# Altium project tcc_semsf_com.PrjPcb
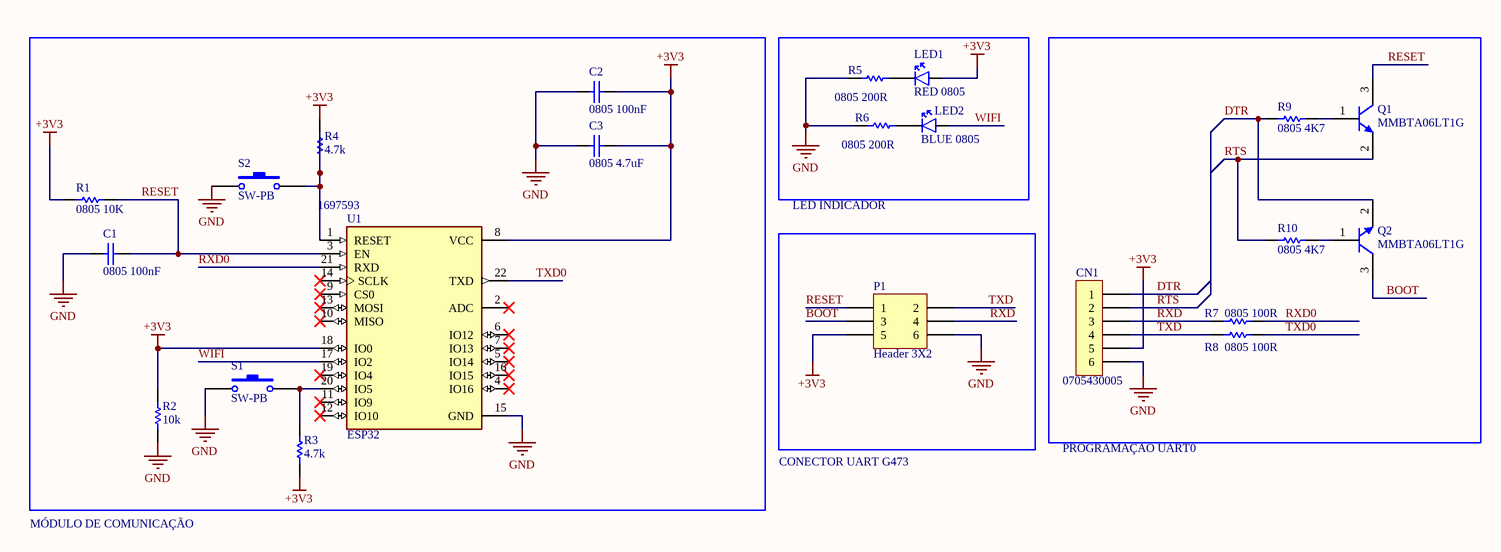
[diagram p0: Main.SchDoc]
1 sheet, 22 parts. Net scope: global (net labels, ports and power ports of the same name join across sheets).
Board file: Main.PcbDoc

## Sheet Main.SchDoc: Comunicação
size A4; Author: Matheus Gois Vieira; Address1: UnB; Address2: Faculdade do Gama

### Parts
C1  0805 100nF  [CAP0805]
C2  0805 100nF  [CAP0805]
C3  0805 4.7uF  [CAP0805]
CN1  0705430005  [FP-0705430005-MFG]
LED1  RED 0805  [LEDC2012X80N]
LED2  BLUE 0805  [LEDC2012X80N]
P1  Header 3X2  [HDR2X3M]
Q1  MMBTA06LT1G  [ONSC-SOT-23-3-318-08_V]
Q2  MMBTA06LT1G  [ONSC-SOT-23-3-318-08_V]
R1  0805 10K  [RES0805]
R2  10k  [R1608[0603]]
R3  4.7k  [R1005[0402]]
R4  4.7k  [R1005[0402]]
R5  0805 200R  [RES0805]
R6  0805 200R  [RES0805]
R7  0805 100R  [RES0805]
R8  0805 100R  [RES0805]
R9  0805 4K7  [RES0805]
R10  0805 4K7  [RES0805]
S1  SW-PB  [PB-SW]
S2  SW-PB  [PB-SW]
U1  ESP32  Supplier Part Number 1: 1697593  [XCVR_ESP8266-12E/ESP-12E]

### Nets
+3V3: C2.2 C3.2 CN1.5 LED1.2(A) P1.5 R1.1 R2.2 R3.2 R4.2 U1.8(VCC) U1.18(IO0)
GND: C1.1 C2.1 C3.1 CN1.6 P1.6 R2.1 R5.1 R6.1 S1.1 S2.1 U1.15(GND)
BOOT: P1.3 Q2.3(C)
DTR: CN1.1 Q2.2(E) R9.1
RESET: C1.2 P1.1 Q1.3(C) R1.2 U1.3(EN)
RTS: CN1.2 Q1.2(E) R10.1
RXD: CN1.3 P1.4 R7.1
RXD0: R7.2 U1.21(RXD)
TXD: CN1.4 P1.2 R8.1
TXD0: R8.2 U1.22(TXD)
WIFI: LED2.2(A) U1.17(IO2)
NetLED1_1: LED1.1(K) R5.2
NetLED2_1: LED2.1(K) R6.2
NetQ1_1: Q1.1(B) R9.2
NetQ2_1: Q2.1(B) R10.2
NetR3_1: R3.1 S1.2 U1.20(IO5)
NetR4_1: R4.1 S2.2 U1.1(RESET)

Not connected (* = marked no-connect by the designer): U1 2(ADC)* 4(IO16)* 5(IO14)* 6(IO12)* 7(IO13)* 9(CS0)* 10(MISO)* 11(IO9)* 12(IO10)* 13(MOSI)* 14(SCLK)* 16(IO15)* 19(IO4)*

### Notes on the sheet
- LED INDICADOR
- CONECTOR UART G473
- PROGRAMAÇÃO UART0
- MÓDULO DE COMUNICAÇÃO
- Title
- Size:
- Date:
- A4
- Author:
- Time:
- Sheet
- of
- File:

### Library data of the parts
C1 C2 = CC0805KRX7R9BB104: CC Series 0805 0.1 uF 50 V ±10 % Tolerance X7R SMT Multilayer Ceramic Capacitor; Manufacturer: Yageo; Tolerance: 10%; Voltage Rating: 50V; Insulation Resistance: 100GR; Supplier 1: Digi-Key; Manufacturer Part Number: CC0805KRX7R9BB104; RoHS: Yes; Category: Ceramic Capacitors; Stock 1: 7319595; Pricing 1: 4000=0,01864, 8000=0,01734 (USD); Mount: Surface Mount; Case/Package: 0805; Number of Pins: 2; Case Code (Metric): 2012; Case Code (Imperial): 0805; Material: Ceramic; Min Operating Temperature: -55°C; Max Operating Temperature: 125°C; Capacitance: 100nF; Dielectric: X7R; Packaging: Tape and Reel; Package Quantity: 1; Termination: SMD/SMT; Voltage: 50V; Series: CC; Length: 2mm; Width: 0.049inch; Height: 0.85mm; Depth: 1.25mm; Thickness: 0.033inch; Radiation Hardening: No; REACH SVHC: No SVHC; Lead Free: Lead Free; Halogen Free: Halogen Free; RoHS Compliant: Yes; ComponentLink1URL: https://datasheet.ciiva.com/11786/0900766b80d84f1d-11786009.pdf?src-supplier=RSComponents; ComponentLink1Description: https://datasheet.ciiva.com/11786/0900766b80d84f1d-11786009.pdf?src-supplier=RSComponents; ComponentLink2URL: https://datasheet.ciiva.com/155/mlccorderingcode-155929.pdf?src-supplier=Digi-Key; ComponentLink2Description: https://datasheet.ciiva.com/155/mlccorderingcode-155929.pdf?src-supplier=Digi-Key; ComponentLink3URL: https://datasheet.ciiva.com/155/mlccorderingcode-155930.pdf?src-supplier=Digi-Key; ComponentLink3Description: https://datasheet.ciiva.com/155/mlccorderingcode-155930.pdf?src-supplier=Digi-Key; ComponentLink4URL: https://datasheet.ciiva.com/155/mlccorderingcode-155931.pdf?src-supplier=Digi-Key; ComponentLink4Description: https://datasheet.ciiva.com/155/mlccorderingcode-155931.pdf?src-supplier=Digi-Key; ComponentLink5URL: https://datasheet.ciiva.com/11464/upy-gphc-x7r-6-3v-to-50v-8-11464757.pdf?src-supplier=Avnet; ComponentLink5Description: https://datasheet.ciiva.com/11464/upy-gphc-x7r-6-3v-to-50v-8-11464757.pdf?src-supplier=Avnet; ComponentLink6URL: https://datasheet.ciiva.com/16625/upy-gphc-x7r-6-3v-to-50v-8-16625549.pdf?src-supplier=Avnet+Europe; ComponentLink6Description: https://datasheet.ciiva.com/16625/upy-gphc-x7r-6-3v-to-50v-8-16625549.pdf?src-supplier=Avnet+Europe; ComponentLink7URL: https://datasheet.ciiva.com/28450/1489800-28450805.pdf?src-supplier=Element14; ComponentLink7Description: https://datasheet.ciiva.com/28450/1489800-28450805.pdf?src-supplier=Element14; ComponentLink8URL: https://datasheet.ciiva.com/46393/1734573-46393307.pdf?src-supplier=Element14; ComponentLink8Description: https://datasheet.ciiva.com/46393/1734573-46393307.pdf?src-supplier=Element14; ComponentLink9URL: https://datasheet.ciiva.com/29242/445210-da-01-en-kerko-chip-0805-x7r-0-1uf-10proz-50vg-29242074.pdf?src-supplier=Conrad; ComponentLink9Description: https://datasheet.ciiva.com/29242/445210-da-01-en-kerko-chip-0805-x7r-0-1uf-10proz-50vg-29242074.pdf?src-supplier=Conrad; Supplier Part Number 1: 311-1140-2-ND
C3 = C2012X5R1H475K125AB: 4.7uF ±10% 50V 0805; Manufacturer: TDK; Dielectric Material: Ceramic; Dielectric: X5R; Supplier 1: RSComponents; Manufacturer Part Number: C2012X5R1H475K125AB; RoHS: Yes; Category: Ceramic Capacitors; Stock 1: 610; Pricing 1: 10=0,38900, 100=0,36600, 250=0,34200, 500=0,32300, 1000=0,29200 (USD); Mount: Surface Mount; Case/Package: 0805; Case Code (Metric): 2012; Case Code (Imperial): 0805; Weight: 0.000194oz; Min Operating Temperature: -55°C; Max Operating Temperature: 85°C; Capacitance: 4.7uF; Tolerance: 10%; Packaging: Tape and Reel; Package Quantity: 1; Voltage Rating: 50V; Series: C; Voltage Rating (DC): 50V; Termination: SMD/SMT; Construction: Flat; Voltage: 50V; Resistor Type: Ceramic; Length: 2mm; Width: 0.049inch; Height: 1.25mm; Depth: 1.25mm; Thickness: 0.057inch; Radiation Hardening: No; RoHS Compliant: Yes; REACH SVHC: No SVHC; Lead Free: Lead Free; ComponentLink1URL: https://datasheet.ciiva.com/24216/c2012x5r1h475k125ab-265006-24216434.pdf?src-supplier=Mouser; ComponentLink1Description: https://datasheet.ciiva.com/24216/c2012x5r1h475k125ab-265006-24216434.pdf?src-supplier=Mouser; ComponentLink2URL: https://datasheet.ciiva.com/22725/1913358-22725564.pdf?src-supplier=Element14; ComponentLink2Description: https://datasheet.ciiva.com/22725/1913358-22725564.pdf?src-supplier=Element14; ComponentLink3URL: https://datasheet.ciiva.com/28673/mlcc-commercial-general-en-28673541.pdf?src-supplier=Element14; ComponentLink3Description: https://datasheet.ciiva.com/28673/mlcc-commercial-general-en-28673541.pdf?src-supplier=Element14; ComponentLink4URL: https://datasheet.ciiva.com/6276/tdkmlcccaprange-6276526.pdf?src-supplier=Digi-Key; ComponentLink4Description: https://datasheet.ciiva.com/6276/tdkmlcccaprange-6276526.pdf?src-supplier=Digi-Key; ComponentLink5URL: https://datasheet.ciiva.com/48671/e412-c-48671374.pdf?src-supplier=Avnet; ComponentLink5Description: https://datasheet.ciiva.com/48671/e412-c-48671374.pdf?src-supplier=Avnet; Supplier Part Number 1: 7883041
CN1 = 0705430005: Conn Shrouded Header (4 Sides) HDR 6 POS 2.54mm Solder ST Top Entry Thru-Hole SL™ Tube; Manufacturer: Molex; Contact Resistance: 30mR; Number of Positions: 6; Connector Type: Male Pin; Pitch: 0.1inch; Supplier 1: RSComponents; Manufacturer Part Number: 0705430005; RoHS: Yes; Category: Headers and Wire Housings; Stock 1: 440; Pricing 1: 10=1,32100, 200=1,15000, 750=0,92500, 3000=0,75400, 6000=0,73000 (USD); Mount: Through Hole; Contact Plating: Gold; Contact Material: Bronze; Color: Black; Housing Color: Black; Housing Material: Polyester; Min Operating Temperature: -40°C; Max Operating Temperature: 105°C; Packaging: Rail/Tube; Number of Rows: 1; Termination: Solder; Orientation: Straight; Series: C-Grid® SL™ 70543; Contact Type: Male Pin; Length: 17.79mm; Depth: 6.6mm; Contact Mating Length: 0.24inch; Radiation Hardening: No; RoHS Compliant: Yes; ComponentLink1URL: http://components.arrow.com/part/dataview/2934603S3153303N3303?src-supplier=Arrow+Electronics; ComponentLink1Description: http://components.arrow.com/part/dataview/2934603S3153303N3303?src-supplier=Arrow+Electronics; ComponentLink2URL: http://components.arrow.com/part/dataview/0323_00048382?src-supplier=Arrow+Europe; ComponentLink2Description: http://components.arrow.com/part/dataview/0323_00048382?src-supplier=Arrow+Europe; Supplier Part Number 1: 6792483
LED1 LED2 = 150080RS75000: Red SMD 625nm LED Indication - Discrete 2V 0805 (2012 Metric); Manufacturer_Name: Wurth Elektronik; Datasheet Link: https://componentsearchengine.com/Datasheets/2/150080RS75000.pdf; Height: 0.8mm; Manufacturer_Part_Number: 150080RS75000; Mouser Part Number: 710-150080RS75000; Mouser Price/Stock: https://www.mouser.co.uk/ProductDetail/Wurth-Elektronik/150080RS75000?qs=LlUlMxKIyB2jdCo7bnfgew%3D%3D
P1 = Header 3X2: Header, 3-Pin, Dual row; LatestRevisionDate: 17-Jul-2002; LatestRevisionNote: Re-released for DXP Platform.; Publisher: Altium Limited
Q1 Q2 = MMBTA06LT1G: Trans GP BJT NPN 80V 0.5A 3-Pin SOT-23 T/R; Manufacturer: ON Semiconductor; Max Power Dissipation: 225mW; Number of Elements: 1; Frequency: 100MHz; Emitter Base Voltage (VEBO): 4V; Collector Emitter Saturation Voltage: 250mV; Max Collector Current: 500mA; Power Dissipation: 300mW; Element Configuration: Single; hFE Min: 100; Supplier 1: Digi-Key; Manufacturer Part Number: MMBTA06LT1G; RoHS: Yes; Category: BJTs; Stock 1: 9300; Pricing 1: 1=0,17000, 10=0,12300, 25=0,11800, 100=0,06650, 500=0,05220, 1000=0,03625 (USD); Case/Package: SOT-23-3; Number of Pins: 3; Contact Plating: Tin,Matte; Min Operating Temperature: -55°C; Max Operating Temperature: 150°C; Package Quantity: 1; Collector Emitter Voltage (VCEO): 80V; Packaging: Tape and Reel; Polarity: NPN; Collector Base Voltage (VCBO): 80V; Collector Emitter Breakdown Voltage: 80V; Transition Frequency: 100MHz; Max Breakdown Voltage: 80V; Max Frequency: 100MHz; Gain Bandwidth Product: 100MHz; Collector-emitter Voltage-Max: 250mV; Series: -; Voltage Rating (DC): 80V; Current Rating: 500mA; Length: 0.119inch; Width: 0.055inch; Height: 0.04inch; Radiation Hardening: No; REACH SVHC: No SVHC; Lead Free: Lead Free; RoHS Compliant: Yes; ComponentLink1URL: https://datasheet.ciiva.com/4722/mmbta05lt1-d-101659-4722113.pdf?src-supplier=Mouser; ComponentLink1Description: https://datasheet.ciiva.com/4722/mmbta05lt1-d-101659-4722113.pdf?src-supplier=Mouser; ComponentLink2URL: https://datasheet.ciiva.com/15139/getdatasheetpartid-137838-15139444.pdf?src-supplier=Verical; ComponentLink2Description: https://datasheet.ciiva.com/15139/getdatasheetpartid-137838-15139444.pdf?src-supplier=Verical; ComponentLink3URL: https://datasheet.ciiva.com/976/mmbta05lt1-d-976473.pdf?src-supplier=Digi-Key; ComponentLink3Description: https://datasheet.ciiva.com/976/mmbta05lt1-d-976473.pdf?src-supplier=Digi-Key; ComponentLink4URL: https://datasheet.ciiva.com/976/mmbta05lt1-d-976474.pdf?src-supplier=Digi-Key; ComponentLink4Description: https://datasheet.ciiva.com/976/mmbta05lt1-d-976474.pdf?src-supplier=Digi-Key; ComponentLink5URL: https://datasheet.ciiva.com/976/mmbta05lt1-d-976475.pdf?src-supplier=Digi-Key; ComponentLink5Description: https://datasheet.ciiva.com/976/mmbta05lt1-d-976475.pdf?src-supplier=Digi-Key; ComponentLink6URL: https://datasheet.ciiva.com/11197/mmbta05lt1-d-11197414.pdf?src-supplier=Avnet; ComponentLink6Description: https://datasheet.ciiva.com/11197/mmbta05lt1-d-11197414.pdf?src-supplier=Avnet; ComponentLink7URL: https://datasheet.ciiva.com/11198/mmbta05lt1-d-11198678.pdf?src-supplier=Avnet; ComponentLink7Description: https://datasheet.ciiva.com/11198/mmbta05lt1-d-11198678.pdf?src-supplier=Avnet; ComponentLink8URL: https://datasheet.ciiva.com/25998/mmbta05lt1-d-25998830.pdf?src-supplier=Avnet+Europe; ComponentLink8Description: https://datasheet.ciiva.com/25998/mmbta05lt1-d-25998830.pdf?src-supplier=Avnet+Europe; ComponentLink9URL: https://datasheet.ciiva.com/16465/mmbta05lt1-d-16465685.pdf?src-supplier=Future+Electronics; ComponentLink9Description: https://datasheet.ciiva.com/16465/mmbta05lt1-d-16465685.pdf?src-supplier=Future+Electronics; ComponentLink10URL: https://datasheet.ciiva.com/7972/mmbta05lt1-d-7972078.pdf?src-supplier=Element14; ComponentLink10Description: https://datasheet.ciiva.com/7972/mmbta05lt1-d-7972078.pdf?src-supplier=Element14; ComponentLink11URL: https://datasheet.ciiva.com/16478/mmbta05lt1-d-16478574.pdf?src-supplier=Avnet+Asia; ComponentLink11Description: https://datasheet.ciiva.com/16478/mmbta05lt1-d-16478574.pdf?src-supplier=Avnet+Asia; Supplier Part Number 1: MMBTA06LT1GOSCT-ND; Supplier 2: Avnet; Supplier Part Number 2: MMBTA06LT1G
R1 = RC0805FR-0710KL: 10K Omhs 0805 ± 1.00% 0.125W ± 100ppm/℃; Manufacturer: Yageo; Manufacturer Part Number: RC0603FR-0710KL; Tolerance: 1%; Resistance: 10kR; Temperature Coefficient: 100ppm/°C; Voltage Rating: 75V; Voltage Rating (DC): 50V; Power Rating: 100mW; RoHS: Yes; Category: Chip SMD Resistors; Stock 1: 19091268; Pricing 1: 5000=0,00312 (USD); Case/Package: 0603; Number of Pins: 2; Case Code (Imperial): 0603; Case Code (Metric): 1608; Weight: 7.1E-05oz; Size Code: 0603; Min Operating Temperature: -55°C; Max Operating Temperature: 155°C; Resistor Type: Thick Film; Packaging: Tape and Reel; Termination: SMD/SMT; Features: Moisture Resistant; Series: RC; Max Power Dissipation: 100mW; Number of Terminations: 2; Resistance Tolerance: 1%; Construction: Rectangular; Length: 1.6mm; Width: 0.8mm; Height: 0.45mm; Depth: 0.8mm; Lead Pitch: 0.3mm; RoHS Compliant: Yes; REACH SVHC: Unknown; Military Standard: Not; Lead Free: Lead Free; ComponentLink1URL: https://datasheet.ciiva.com/7660/38590-7660789.pdf?src-supplier=Element14; ComponentLink1Description: https://datasheet.ciiva.com/7660/38590-7660789.pdf?src-supplier=Element14; ComponentLink2URL: https://datasheet.ciiva.com/7983/443971-7983596.pdf?src-supplier=Element14; ComponentLink2Description: https://datasheet.ciiva.com/7983/443971-7983596.pdf?src-supplier=Element14; ComponentLink3URL: https://datasheet.ciiva.com/22747/443971-22747519.pdf?src-supplier=Element14; ComponentLink3Description: https://datasheet.ciiva.com/22747/443971-22747519.pdf?src-supplier=Element14; ComponentLink4URL: https://datasheet.ciiva.com/46440/1868787-46440891.pdf?src-supplier=Element14; ComponentLink4Description: https://datasheet.ciiva.com/46440/1868787-46440891.pdf?src-supplier=Element14; ComponentLink5URL: https://datasheet.ciiva.com/7746/1738695-7746239.pdf?src-supplier=Element14; ComponentLink5Description: https://datasheet.ciiva.com/7746/1738695-7746239.pdf?src-supplier=Element14; ComponentLink6URL: https://datasheet.ciiva.com/15189/getdatasheetpartid-409289-15189591.pdf?src-supplier=Verical; ComponentLink6Description: https://datasheet.ciiva.com/15189/getdatasheetpartid-409289-15189591.pdf?src-supplier=Verical; Stock 2: 435000; Pricing 2: 5000=0,00700 (USD); Package Quantity: 1; Technology: THICK FILM; ComponentLink7URL: https://datasheet.ciiva.com/11808/0900766b8106beab-11808151.pdf?src-supplier=RSComponents; ComponentLink7Description: https://datasheet.ciiva.com/11808/0900766b8106beab-11808151.pdf?src-supplier=RSComponents; ComponentLink8URL: https://datasheet.ciiva.com/46447/444164-46447563.pdf?src-supplier=Element14; ComponentLink8Description: https://datasheet.ciiva.com/46447/444164-46447563.pdf?src-supplier=Element14; ComponentLink9URL: https://datasheet.ciiva.com/2456/pyu-r-int-thick-7-2456973.pdf?src-supplier=Digi-Key; ComponentLink9Description: https://datasheet.ciiva.com/2456/pyu-r-int-thick-7-2456973.pdf?src-supplier=Digi-Key; ComponentLink10URL: https://datasheet.ciiva.com/2456/pyu-r-int-thick-7-2456974.pdf?src-supplier=Digi-Key; ComponentLink10Description: https://datasheet.ciiva.com/2456/pyu-r-int-thick-7-2456974.pdf?src-supplier=Digi-Key; ComponentLink11URL: https://datasheet.ciiva.com/2456/pyu-r-int-thick-7-2456972.pdf?src-supplier=Digi-Key; ComponentLink11Description: https://datasheet.ciiva.com/2456/pyu-r-int-thick-7-2456972.pdf?src-supplier=Digi-Key; ComponentLink12URL: https://datasheet.ciiva.com/12669/rc0805-12669688.pdf?src-supplier=Mouser; ComponentLink12Description: https://datasheet.ciiva.com/12669/rc0805-12669688.pdf?src-supplier=Mouser; ComponentLink13URL: https://datasheet.ciiva.com/16747/rc0805-16747087.pdf?src-supplier=Future+Electronics; ComponentLink13Description: https://datasheet.ciiva.com/16747/rc0805-16747087.pdf?src-supplier=Future+Electronics; Supplier 1: RSComponents; Supplier Part Number 1: 6185163
R2 = R: Res, 10K, 0.01%, 0.25W, 1206, Metal Foil; Manufacturer Part Number: Y163010K0000T9R; Value: 0; Resistance: 10kR; Max Power Dissipation: 250mW; Temperature Coefficient: 0.2ppm/°C; Manufacturer: *; PartNumber: *; Package Type: *; Supplier 1: Digi-Key; Supplier Part Number 1: Y1630-10.0KBCT-ND; RoHS: Yes; Category: Chip SMD Resistors; Stock 1: 1437; Pricing 1: 1=11,40000, 10=10,36300, 25=9,32640, 50=8,03100, 100=7,38340 (USD); Case/Package: 1206; Case Code (Metric): 3216; Case Code (Imperial): 1206; Min Operating Temperature: -55°C; Max Operating Temperature: 150°C; Package Quantity: 1; Packaging: Tape and Reel; Tolerance: 0.01%; Resistor Type: Metal Foil; Number of Terminations: 2; Features: Moisture Resistant,Anti-Sulfur; Length: 0.126inch; Width: 0.062inch; Height: 0.025inch; RoHS Compliant: Yes; ComponentLink1URL: https://datasheet.ciiva.com/29711/vfcpseri-29711161.pdf?src-supplier=Digi-Key; ComponentLink1Description: https://datasheet.ciiva.com/29711/vfcpseri-29711161.pdf?src-supplier=Digi-Key; ComponentLink2URL: https://datasheet.ciiva.com/29711/vfcpseri-29711162.pdf?src-supplier=Digi-Key; ComponentLink2Description: https://datasheet.ciiva.com/29711/vfcpseri-29711162.pdf?src-supplier=Digi-Key; ComponentLink3URL: https://datasheet.ciiva.com/18610/vfcpseri-18610015.pdf?src-supplier=Digi-Key; ComponentLink3Description: https://datasheet.ciiva.com/18610/vfcpseri-18610015.pdf?src-supplier=Digi-Key
R3 R4 = R: Res Thick Film 1206 4.7K Ohm 5% 1/4W ±200ppm/°C Molded SMD Punched Carrier T/R; Manufacturer Part Number: ERJ-8GEYJ472V; Value: 0; Resistance: 4.7kR; Voltage Rating: 200V; Power Rating: 250mW; Manufacturer: *; PartNumber: *; Package Type: *; Supplier 1: Newark; Supplier Part Number 1: 65T8944; RoHS: Yes; Category: Chip SMD Resistors; Stock 1: 49650; Pricing 1: 1=0,20200, 25=0,15000, 50=0,10600, 100=0,06200, 250=0,05000, 500=0,03600, 1000=0,02400 (USD); Mount: Surface Mount; Case/Package: 1206; Contact Plating: Tin; Case Code (Imperial): 1206; Case Code (Metric): 3216; Size Code: 1206; Min Operating Temperature: -55°C; Max Operating Temperature: 155°C; Tolerance: 5%; Resistor Type: Thick Film; Temperature Coefficient: 200ppm/°C; Packaging: Tape and Reel; Package Quantity: 1; Termination: SMD/SMT; Number of Terminations: 2; Max Power Dissipation: 250mW; Voltage Rating (DC): 200V; Features: Automotive AEC-Q200; Series: ERJ; Resistance Tolerance: 5%; Construction: Rectangular; Length: 3.2mm; Width: 1.6mm; Height: 0.028inch; Depth: 1.6mm; Radiation Hardening: No; REACH SVHC: No SVHC; Military Standard: Not; Lead Free: Lead Free; RoHS Compliant: Yes; ComponentLink1URL: https://datasheet.ciiva.com/22781/1500035-22781542.pdf?src-supplier=Farnell; ComponentLink1Description: https://datasheet.ciiva.com/22781/1500035-22781542.pdf?src-supplier=Farnell; ComponentLink2URL: https://datasheet.ciiva.com/46377/1500035-46377622.pdf?src-supplier=Element14; ComponentLink2Description: https://datasheet.ciiva.com/46377/1500035-46377622.pdf?src-supplier=Element14; ComponentLink3URL: https://datasheet.ciiva.com/28514/1678796-28514270.pdf?src-supplier=Element14; ComponentLink3Description: https://datasheet.ciiva.com/28514/1678796-28514270.pdf?src-supplier=Element14; ComponentLink4URL: https://datasheet.ciiva.com/28683/1678796-28683449.pdf?src-supplier=Element14; ComponentLink4Description: https://datasheet.ciiva.com/28683/1678796-28683449.pdf?src-supplier=Element14; ComponentLink5URL: https://datasheet.ciiva.com/16774/70255313-16774777.pdf?src-supplier=Allied+Electronics; ComponentLink5Description: https://datasheet.ciiva.com/16774/70255313-16774777.pdf?src-supplier=Allied+Electronics; ComponentLink6URL: https://datasheet.ciiva.com/9195/aoa0000ce1-9195692.pdf?src-supplier=Avnet; ComponentLink6Description: https://datasheet.ciiva.com/9195/aoa0000ce1-9195692.pdf?src-supplier=Avnet; ComponentLink7URL: https://datasheet.ciiva.com/16508/aoa0000ce1-16508170.pdf?src-supplier=Future+Electronics; ComponentLink7Description: https://datasheet.ciiva.com/16508/aoa0000ce1-16508170.pdf?src-supplier=Future+Electronics; ComponentLink8URL: https://datasheet.ciiva.com/15159/getdatasheetpartid-250262-15159117.pdf?src-supplier=Verical; ComponentLink8Description: https://datasheet.ciiva.com/15159/getdatasheetpartid-250262-15159117.pdf?src-supplier=Verical; ComponentLink9URL: https://datasheet.ciiva.com/48531/aoa0000ce1-48531983.pdf?src-supplier=Avnet; ComponentLink9Description: https://datasheet.ciiva.com/48531/aoa0000ce1-48531983.pdf?src-supplier=Avnet; ComponentLink10URL: https://datasheet.ciiva.com/30085/4aoa0000ce1-30085593.pdf?src-supplier=Onlinecomponents.com; ComponentLink10Description: https://datasheet.ciiva.com/30085/4aoa0000ce1-30085593.pdf?src-supplier=Onlinecomponents.com; ComponentLink11URL: https://datasheet.ciiva.com/17213/aoa0000ce1-17213195.pdf?src-supplier=Avnet+Europe; ComponentLink11Description: https://datasheet.ciiva.com/17213/aoa0000ce1-17213195.pdf?src-supplier=Avnet+Europe; ComponentLink12URL: https://datasheet.ciiva.com/16512/aoa0000ce1-16512492.pdf?src-supplier=Avnet+Asia; ComponentLink12Description: https://datasheet.ciiva.com/16512/aoa0000ce1-16512492.pdf?src-supplier=Avnet+Asia
R5 R6 = RC0805FR-07200RL: 200 Ohm  0805 ± 1.00% 0.125W ± 100ppm/℃; Manufacturer: Yageo; Manufacturer Part Number: RC0603FR-07200RL; Tolerance: 1%; Power Rating: 100mW; Voltage Rating: 50V; Temperature Coefficient: 100ppm/°C; Working Voltage: 75V; RoHS: Yes; Category: Chip SMD Resistors; Stock 1: 1049; Pricing 1: 1=0,10000, 10=0,02400, 100=0,00970, 1000=0,00436, 2500=0,00378 (USD); Case/Package: 0603; Number of Pins: 2; Case Code (Imperial): 0603; Case Code (Metric): 1608; Min Operating Temperature: -55°C; Max Operating Temperature: 155°C; Packaging: Tape and Reel; Resistance: 200R; Package Quantity: 5000; Termination: SMD/SMT; Resistor Type: Thick Film; Voltage Rating (DC): 50V; Number of Terminations: 2; Features: Moisture Resistant; Series: RC; Max Power Dissipation: 100mW; Resistance Tolerance: 1%; Construction: Rectangular; Technology: THICK FILM; Length: 1.6mm; Width: 0.8mm; Height: 0.45mm; Depth: 0.8mm; REACH SVHC: No SVHC; Military Standard: Not; Lead Free: Lead Free; RoHS Compliant: Yes; ComponentLink1URL: https://datasheet.ciiva.com/11809/0900766b80f96399-11809240.pdf?src-supplier=RSComponents; ComponentLink1Description: https://datasheet.ciiva.com/11809/0900766b80f96399-11809240.pdf?src-supplier=RSComponents; ComponentLink2URL: https://datasheet.ciiva.com/46395/443971-46395029.pdf?src-supplier=Element14; ComponentLink2Description: https://datasheet.ciiva.com/46395/443971-46395029.pdf?src-supplier=Element14; Stock 2: 1; Pricing 2: 5000=0,00300 (USD); Mount: Surface Mount; Size Code: 0805; ComponentLink3URL: https://datasheet.ciiva.com/2519/pyu-r-int-thick-7-2519721.pdf?src-supplier=Digi-Key; ComponentLink3Description: https://datasheet.ciiva.com/2519/pyu-r-int-thick-7-2519721.pdf?src-supplier=Digi-Key; ComponentLink4URL: https://datasheet.ciiva.com/2519/pyu-r-int-thick-7-2519722.pdf?src-supplier=Digi-Key; ComponentLink4Description: https://datasheet.ciiva.com/2519/pyu-r-int-thick-7-2519722.pdf?src-supplier=Digi-Key; ComponentLink5URL: https://datasheet.ciiva.com/2519/pyu-r-int-thick-7-2519720.pdf?src-supplier=Digi-Key; ComponentLink5Description: https://datasheet.ciiva.com/2519/pyu-r-int-thick-7-2519720.pdf?src-supplier=Digi-Key; ComponentLink6URL: https://datasheet.ciiva.com/12667/rc0805-12667066.pdf?src-supplier=Mouser; ComponentLink6Description: https://datasheet.ciiva.com/12667/rc0805-12667066.pdf?src-supplier=Mouser; ComponentLink7URL: https://datasheet.ciiva.com/15189/getdatasheetpartid-327982-15189926.pdf?src-supplier=Verical; ComponentLink7Description: https://datasheet.ciiva.com/15189/getdatasheetpartid-327982-15189926.pdf?src-supplier=Verical; Supplier 1: RSComponents; Supplier Part Number 1: 6183842
R7 R8 = RC0805FR-07100RL: 100R ± 1.00% 0.125W ± 100ppm/℃ 0805; Manufacturer: Yageo; Tolerance: 1%; Voltage Rating (DC): 150V; Temperature Coefficient: 100ppm/°C; Power Rating: 125mW; Application(s): HIGH RELIABILITY; Supplier 1: RSComponents; Manufacturer Part Number: RC0805FR-07100RL; RoHS: Yes; Category: Chip SMD Resistors; Stock 1: 45000; Pricing 1: 5000=0,00700 (USD); Case/Package: 0805; Number of Pins: 2; Case Code (Imperial): 0805; Case Code (Metric): 2012; Weight: 0.000917oz; Min Operating Temperature: -55°C; Max Operating Temperature: 155°C; Resistance: 100R; Packaging: Cut Tape; Resistor Type: Thick Film; Voltage Rating: 150V; Package Quantity: 5000; Termination: SMD/SMT; Number of Terminations: 2; Max Power Dissipation: 125mW; Features: Moisture Resistant; Type: General Purpose; Series: RC; Technology: THICK FILM; Length: 2mm; Width: 1.25mm; Height: 0.5mm; Depth: 1.25mm; Lead Pitch: 0.4mm; REACH SVHC: Unknown; Lead Free: Lead Free; Military Standard: Not; RoHS Compliant: Yes; ComponentLink1URL: https://datasheet.ciiva.com/11808/0900766b8106beab-11808877.pdf?src-supplier=RSComponents; ComponentLink1Description: https://datasheet.ciiva.com/11808/0900766b8106beab-11808877.pdf?src-supplier=RSComponents; ComponentLink2URL: https://datasheet.ciiva.com/7941/1697719-7941680.pdf?src-supplier=Element14; ComponentLink2Description: https://datasheet.ciiva.com/7941/1697719-7941680.pdf?src-supplier=Element14; ComponentLink3URL: https://datasheet.ciiva.com/7941/1686128-7941679.pdf?src-supplier=Element14; ComponentLink3Description: https://datasheet.ciiva.com/7941/1686128-7941679.pdf?src-supplier=Element14; ComponentLink4URL: https://datasheet.ciiva.com/7660/38627-7660797.pdf?src-supplier=Element14; ComponentLink4Description: https://datasheet.ciiva.com/7660/38627-7660797.pdf?src-supplier=Element14; ComponentLink5URL: https://datasheet.ciiva.com/22747/444164-22747535.pdf?src-supplier=Element14; ComponentLink5Description: https://datasheet.ciiva.com/22747/444164-22747535.pdf?src-supplier=Element14; ComponentLink6URL: https://datasheet.ciiva.com/46447/444164-46447562.pdf?src-supplier=Element14; ComponentLink6Description: https://datasheet.ciiva.com/46447/444164-46447562.pdf?src-supplier=Element14; ComponentLink7URL: https://datasheet.ciiva.com/2456/pyu-r-int-thick-7-2456988.pdf?src-supplier=Digi-Key; ComponentLink7Description: https://datasheet.ciiva.com/2456/pyu-r-int-thick-7-2456988.pdf?src-supplier=Digi-Key; ComponentLink8URL: https://datasheet.ciiva.com/2456/pyu-r-int-thick-7-2456989.pdf?src-supplier=Digi-Key; ComponentLink8Description: https://datasheet.ciiva.com/2456/pyu-r-int-thick-7-2456989.pdf?src-supplier=Digi-Key; ComponentLink9URL: https://datasheet.ciiva.com/2456/pyu-r-int-thick-7-2456987.pdf?src-supplier=Digi-Key; ComponentLink9Description: https://datasheet.ciiva.com/2456/pyu-r-int-thick-7-2456987.pdf?src-supplier=Digi-Key; ComponentLink10URL: https://datasheet.ciiva.com/17082/rc0805-17082697.pdf?src-supplier=Future+Electronics; ComponentLink10Description: https://datasheet.ciiva.com/17082/rc0805-17082697.pdf?src-supplier=Future+Electronics; Supplier Part Number 1: 6185135
R9 R10 = RC0805FR-074K7L: 4700Ω ± 1.00% 0.125W ± 100ppm/℃ 0805; Manufacturer: Yageo; Voltage Rating (DC): 150V; Resistance: 4.7kR; Tolerance: 1%; Temperature Coefficient: 100ppm/°C; Power Rating: 125mW; Supplier 1: RSComponents; Manufacturer Part Number: RC0805FR-074K7L; RoHS: Yes; Category: Chip SMD Resistors; Stock 1: 305000; Pricing 1: 5000=0,00700 (USD); Case/Package: 0805; Number of Pins: 2; Case Code (Metric): 2012; Case Code (Imperial): 0805; Size Code: 0805; Min Operating Temperature: -55°C; Max Operating Temperature: 155°C; Resistor Type: Thick Film; Packaging: Tape and Reel; Package Quantity: 5000; Voltage Rating: 150V; Number of Terminations: 2; Termination: SMD/SMT; Max Power Dissipation: 125mW; Features: Moisture Resistant; Series: RC; Resistance Tolerance: 1%; Technology: THICK FILM; Construction: Rectangular; Length: 0.079inch; Width: 0.049inch; Height: 0.024inch; Depth: 1.25mm; REACH SVHC: No SVHC; Lead Free: Lead Free; RoHS Compliant: Yes; Military Standard: Not; ComponentLink1URL: https://datasheet.ciiva.com/11808/0900766b8106beab-11808155.pdf?src-supplier=RSComponents; ComponentLink1Description: https://datasheet.ciiva.com/11808/0900766b8106beab-11808155.pdf?src-supplier=RSComponents; ComponentLink2URL: https://datasheet.ciiva.com/7941/1686128-7941805.pdf?src-supplier=Element14; ComponentLink2Description: https://datasheet.ciiva.com/7941/1686128-7941805.pdf?src-supplier=Element14; ComponentLink3URL: https://datasheet.ciiva.com/46447/444164-46447583.pdf?src-supplier=Element14; ComponentLink3Description: https://datasheet.ciiva.com/46447/444164-46447583.pdf?src-supplier=Element14; ComponentLink4URL: https://datasheet.ciiva.com/6547/pyu-r-int-thick-7-6547263.pdf?src-supplier=Digi-Key; ComponentLink4Description: https://datasheet.ciiva.com/6547/pyu-r-int-thick-7-6547263.pdf?src-supplier=Digi-Key; ComponentLink5URL: https://datasheet.ciiva.com/7941/444164-7941804.pdf?src-supplier=Element14; ComponentLink5Description: https://datasheet.ciiva.com/7941/444164-7941804.pdf?src-supplier=Element14; ComponentLink6URL: https://datasheet.ciiva.com/7941/444164-7941806.pdf?src-supplier=Element14; ComponentLink6Description: https://datasheet.ciiva.com/7941/444164-7941806.pdf?src-supplier=Element14; Supplier Part Number 1: 6181408
S1 S2 = SW Tact: Tactile Switch; Manufacturer: *; PartNumber: *; Package Type: *
U1 = ESP8266-12E/ESP-12E: This WiFi module has a 32-bit MCU micro and clock speeds supporting 80 MHz or 160 MHz. Supports the RTOS and integrated Wi-Fi MAC/BB/RF/PA/LNA, and has an on-board antenna.; MF: AI-Thinker; Price: None; Package: None; Value: *; MP: ESP8266-12E/ESP-12E; Availability: Unavailable; SnapEDA_Link: https://www.snapeda.com/parts/ESP8266-12E/ESP-12E/AI-Thinker/view-part/106414/?ref=snap; Supplier 1: RSComponents